# Altium schematic sheet POWER.SchDoc
size 420 x 297 mm; SheetNumber: 13; PageSetup: Record=PageOptions|CenterHorizontal=False|CenterVertical=False|PrintScale=0.95|XCorrection=0.00|YCorrection=0.00|PrintKind=1|BorderSize=5000000|LeftOffset=0|BottomOffset=0|Orientation=1|PaperLength=1000|PaperWidth=1000|Scale=100|PaperSource=15|PrintQuality=600|MediaType=1|DitherType=10|PaperKind=A4|PrintScaleMode=1
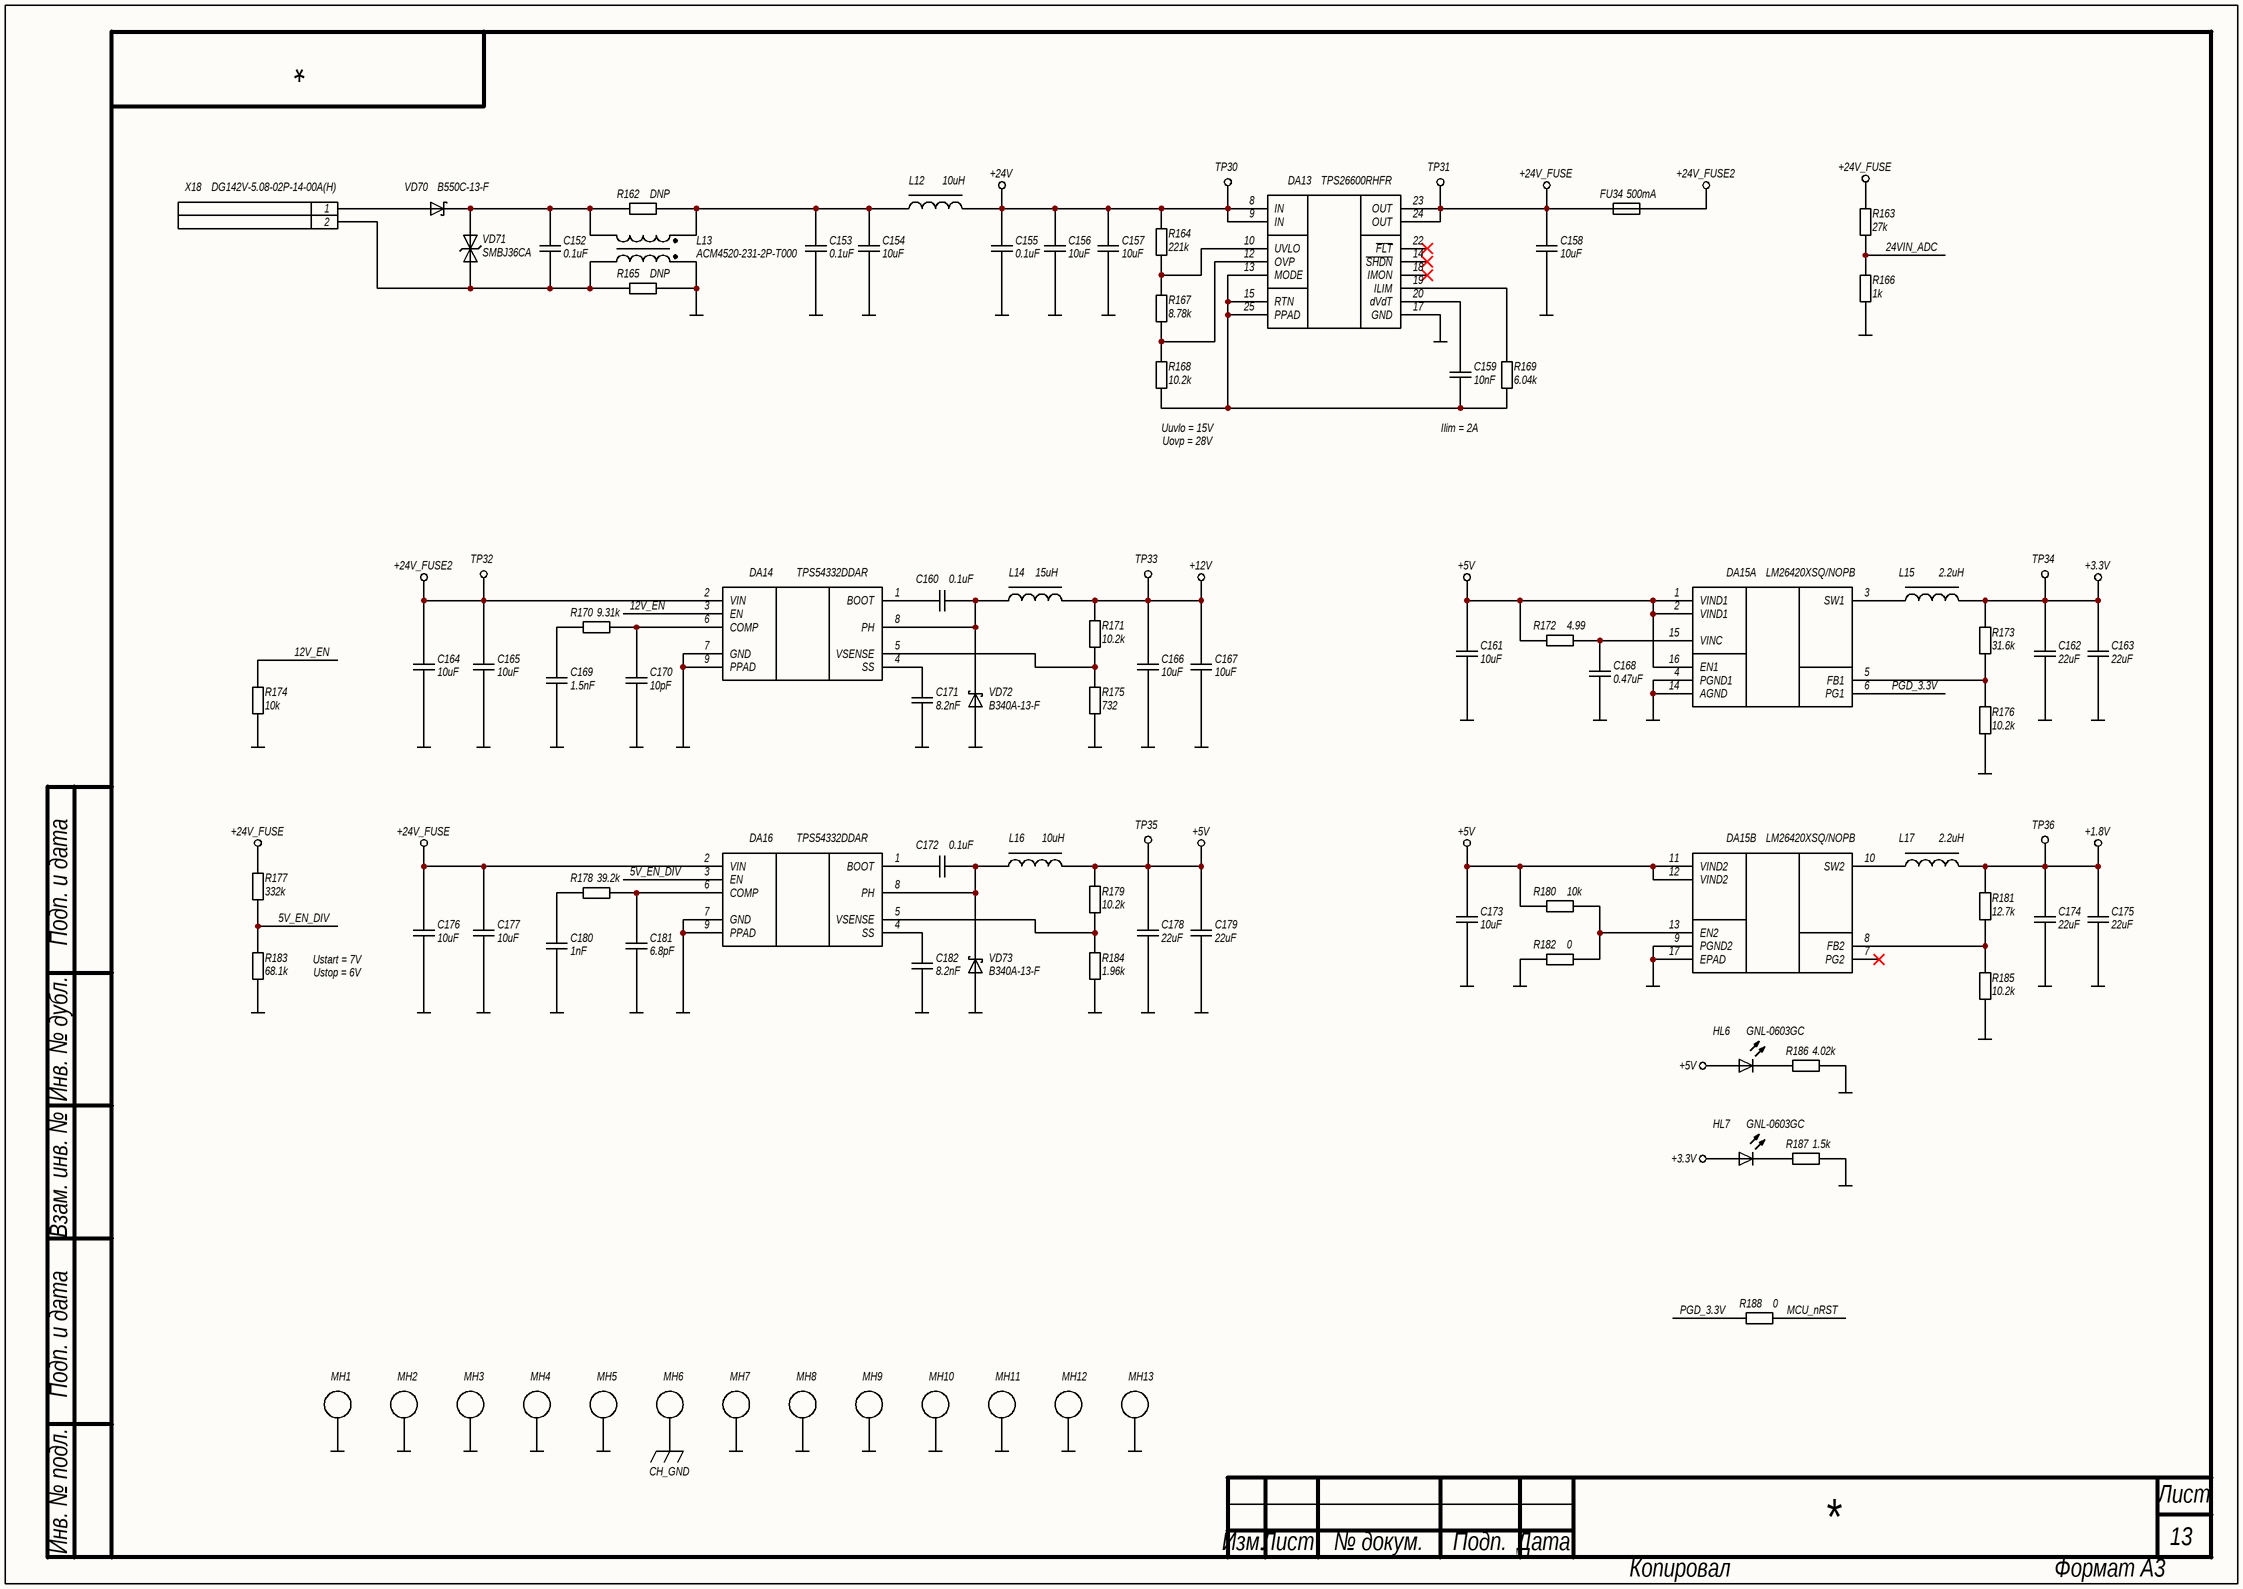
[diagram p0: POWER.SchDoc]

## Parts
C152  0.1uF  [C0805N]
C153  0.1uF  [C0805N]
C154  10uF  [C1206N]
C155  0.1uF  [C0805N]
C156  10uF  [C1206N]
C157  10uF  [C1206N]
C158  10uF  [C1206N]
C159  10nF  [C0603N]
C160  0.1uF  [C0603N]
C161  10uF  [C0805N]
C162  22uF  [C0805N]
C163  22uF  [C0805N]
C164  10uF  [C1206N]
C165  10uF  [C1206N]
C166  10uF  [C0805N]
C167  10uF  [C0805N]
C168  0.47uF  [C0603N]
C169  1.5nF  [C0603N]
C170  10pF  [C0603N]
C171  8.2nF  [C0603N]
C172  0.1uF  [C0603N]
C173  10uF  [C0805N]
C174  22uF  [C0805N]
C175  22uF  [C0805N]
C176  10uF  [C1206N]
C177  10uF  [C1206N]
C178  22uF  [C0805N]
C179  22uF  [C0805N]
C180  1nF  [C0603N]
C181  6.8pF  [C0603N]
C182  8.2nF  [C0603N]
DA13  TPS26600RHFR  [RHF0024A (VQFN-24 EP)]
DA14  TPS54332DDAR  [SOIC8-EP]
DA15  LM26420XSQ/NOPB  [RUM0016A]  (parts A,B of 2)
DA16  TPS54332DDAR  [SOIC8-EP]
FU34  500mA  [MF-MSMF]
HL6  GNL-0603GC  [LED0603]
HL7  GNL-0603GC  [LED0603]
L12  10uH  [SRN8040]
L13  ACM4520-231-2P-T000  [ACM4520]
L14  15uH  [SRN8040]
L15  2.2uH  [VLS3012HBX]
L16  10uH  [SRN8040]
L17  2.2uH  [VLS3012HBX]
MH1  MNT_HOLE_PL  [MH_3.2_5.4_PLATED_VIA]  (value not drawn)  (no BOM)
MH2  MNT_HOLE_PL  [MH_3.2_5.4_PLATED_VIA]  (value not drawn)  (no BOM)
MH3  MNT_HOLE_PL  [MH_3.2_5.4_PLATED_VIA]  (value not drawn)  (no BOM)
MH4  MNT_HOLE_PL  [MH_3.2_5.4_PLATED_VIA]  (value not drawn)  (no BOM)
MH5  MNT_HOLE_PL  [MH_3.2_5.4_PLATED_VIA]  (value not drawn)  (no BOM)
MH6  MNT_HOLE_PL  [MH_3.2_5.4_PLATED_VIA]  (value not drawn)  (no BOM)
MH7  MNT_HOLE_PL  [MH_3.2_5.4_PLATED_VIA]  (value not drawn)  (no BOM)
MH8  MNT_HOLE_PL  [MH_3.2_5.4_PLATED_VIA]  (value not drawn)  (no BOM)
MH9  MNT_HOLE_PL  [MH_3.2_5.4_PLATED_VIA]  (value not drawn)  (no BOM)
MH10  MNT_HOLE_PL  [MH_3.2_5.4_PLATED_VIA]  (value not drawn)  (no BOM)
MH11  MNT_HOLE_PL  [MH_3.2_5.4_PLATED_VIA]  (value not drawn)  (no BOM)
MH12  MNT_HOLE_PL  [MH_3.2_5.4_PLATED_VIA]  (value not drawn)  (no BOM)
MH13  MNT_HOLE_PL  [MH_3.2_5.4_PLATED_VIA]  (value not drawn)  (no BOM)
R162  DNP  [R1206N]  (no BOM)
R163  27k  [R0603N]
R164  221k  [R0603N]
R165  DNP  [R1206N]  (no BOM)
R166  1k  [R0603N]
R167  8.78k  [R0603N]
R168  10.2k  [R0603N]
R169  6.04k  [R0603N]
R170  9.31k  [R0603N]
R171  10.2k  [R0603N]
R172  4.99  [R0603N]
R173  31.6k  [R0603N]
R174  10k  [R0603N]
R175  732  [R0603N]
R176  10.2k  [R0603N]
R177  332k  [R0603N]
R178  39.2k  [R0603N]
R179  10.2k  [R0603N]
R180  10k  [R0603N]
R181  12.7k  [R0603N]
R182  0  [R0603N]
R183  68.1k  [R0603N]
R184  1.96k  [R0603N]
R185  10.2k  [R0603N]
R186  4.02k  [R0603N]
R187  1.5k  [R0603N]
R188  0  [R0603N]
TP30  TEST_POINT  [TP_RPAD_0.8MM]  (value not drawn)  (no BOM)
TP31  TEST_POINT  [TP_RPAD_0.8MM]  (value not drawn)  (no BOM)
TP32  TEST_POINT  [TP_RPAD_0.8MM]  (value not drawn)  (no BOM)
TP33  TEST_POINT  [TP_RPAD_0.8MM]  (value not drawn)  (no BOM)
TP34  TEST_POINT  [TP_RPAD_0.8MM]  (value not drawn)  (no BOM)
TP35  TEST_POINT  [TP_RPAD_0.8MM]  (value not drawn)  (no BOM)
TP36  TEST_POINT  [TP_RPAD_0.8MM]  (value not drawn)  (no BOM)
VD70  B550C-13-F  [SMC]
VD71  SMBJ36CA  [SMB]
VD72  B340A-13-F  [SMA]
VD73  B340A-13-F  [SMA]
X18  DG142V-5.08-02P-14-00A(H)  [DG142V-5.08-02P-14-00A(H)]

## Nets
+1.8V: C174.2 C175.2 L17.2 R181.1 TP36.1
+3.3V: C162.2 C163.2 HL7.2(A) L15.2 R173.1 TP34.1
+5V: C161.2 C173.2 C178.2 C179.2 DA15.1(VIND1) DA15.2(VIND1) DA15.11(VIND2) DA15.12(VIND2) DA15.16(EN1) HL6.2(A) L16.2 R172.2 R179.1 R180.2 TP35.1
+12V: C166.2 C167.2 L14.2 R171.1 TP33.1
+24V: C155.2 C156.2 C157.2 DA13.8(IN) DA13.9(IN) L12.2 R164.2 TP30.1
+24V_FUSE: C158.2 C176.2 C177.2 DA13.23(OUT) DA13.24(OUT) DA16.2(VIN) FU34.1 R163.2 R177.1 TP31.1
+24V_FUSE2: C164.2 C165.2 DA14.2(VIN) FU34.2 TP32.1
CH_GND: MH6.1
GND: C153.1 C154.1 C155.1 C156.1 C157.1 C158.1 C161.1 C162.1 C163.1 C164.1 C165.1 C166.1 C167.1 C168.1 C169.1 C170.1 C171.1 C173.1 C174.1 C175.1 C176.1 C177.1 C178.1 C179.1 C180.1 C181.1 C182.1 DA13.17(GND) DA14.7(GND) DA14.9(PPAD) DA15.4(PGND1) DA15.9(PGND2) DA15.14(AGND) DA15.17(EPAD) DA16.7(GND) DA16.9(PPAD) L13.1 MH1.1 MH2.1 MH3.1 MH4.1 MH5.1 MH7.1 MH8.1 MH9.1 MH10.1 MH11.1 MH12.1 MH13.1 R165.2 R166.1 R174.1 R175.2 R176.2 R182.2 R183.2 R184.2 R185.2 R186.1 R187.1 VD72.2(A) VD73.2(A)
5V_EN_DIV: DA16.3(EN) R177.2 R183.1
12V_EN: DA14.3(EN) R174.2
24VIN_ADC: R163.1 R166.2
MCU_nRST: R188.2
PGD_3.3V: DA15.6(PG1) R188.1
NetC152_1: C152.1 L13.2 R165.1 VD71.2(A2) X18.2
NetC152_2: C152.2 L13.3 R162.1 VD70.1(K) VD71.1(A1)
NetC153_2: C153.2 C154.2 L12.1 L13.4 R162.2
NetC159_1: C159.1 DA13.20(dVdT)
NetC159_2: C159.2 DA13.13(MODE) DA13.15(RTN) DA13.25(PPAD) R168.2 R169.1
NetC160_1: C160.1 DA14.8(PH) L14.1 VD72.1(K)
NetC160_2: C160.2 DA14.1(BOOT)
NetC168_2: C168.2 DA15.15(VINC) R172.1
NetC169_2: C169.2 R170.2
NetC170_2: C170.2 DA14.6(COMP) R170.1
NetC171_2: C171.2 DA14.4(SS)
NetC172_1: C172.1 DA16.8(PH) L16.1 VD73.1(K)
NetC172_2: C172.2 DA16.1(BOOT)
NetC180_2: C180.2 R178.2
NetC181_2: C181.2 DA16.6(COMP) R178.1
NetC182_2: C182.2 DA16.4(SS)
NetDA13_10: DA13.10(UVLO) R164.1 R167.2
NetDA13_12: DA13.12(OVP) R167.1 R168.1
NetDA13_19: DA13.19(ILIM) R169.2
NetDA14_5: DA14.5(VSENSE) R171.2 R175.1
NetDA15_3: DA15.3(SW1) L15.1
NetDA15_5: DA15.5(FB1) R173.2 R176.1
NetDA15_8: DA15.8(FB2) R181.2 R185.1
NetDA15_10: DA15.10(SW2) L17.1
NetDA15_13: DA15.13(EN2) R180.1 R182.1
NetDA16_5: DA16.5(VSENSE) R179.2 R184.1
NetHL6_1: HL6.1(K) R186.2
NetHL7_1: HL7.1(K) R187.2
NetVD70_2: VD70.2(A) X18.1

Not connected (* = marked no-connect by the designer): DA13 14(~{SHDN})* 18(IMON)* 22(~{FLT})*; DA15 7(PG2)*

## Notes on the sheet
- (near R168) Uuvlo = 15V
- (near R168) Uovp = 28V
- Ilim = 2A
- Ustart = 7V
- Ustop = 6V
- Подп. и дата
- Инв. № дубл.
- Взам. инв. №
- Инв. № подл.
- Лист
- Изм.
- № докум.
- Подп.
- Дата
- Копировал
- Формат А3

## Library data of the parts
C152 C153 C155 = CL21B104KCFNNNE: Конденсатор; Точность: 10%; Напряжение: 100V; Диэлектрик: X7R; Производитель: Samsung Electro-Mechanics; Описание: 0.1 µF ±10% 100V Ceramic Capacitor X7R 0805 (2012 Metric); Корпус: 0805 (2012 Metric); Температурный диапазон: -55°C ~ 125°C; Вид монтажа: SMD; Артикул: CL21B104KCFNNNE; Номинал: 0.1uF; Строка для документации: https://mm.digikey.com/Volume0/opasdata/d220001/medias/docus/893/CL21B104KCFNNNE_Spec.pdf; Тип элемента: Конденсатор
C154 C156-C158 C164 C165 C176 C177 = CL31B106KBHNNNE: Конденсатор; Точность: 10%; Напряжение: 50V; Диэлектрик: X7R; Производитель: Samsung Electro-Mechanics; Описание: 10 µF ±10% 50V Ceramic Capacitor X7R 1206 (3216 Metric); Корпус: 1206 (3216 Metric); Температурный диапазон: -55°C ~ 125°C; Вид монтажа: SMD; Артикул: CL31B106KBHNNNE; Номинал: 10uF; Строка для документации: https://mm.digikey.com/Volume0/opasdata/d220001/medias/docus/41/CL31B106KBHNNNE_Spec.pdf; Тип элемента: Конденсатор
C159 = CL10B103KB8NNNC: Конденсатор; Точность: 10%; Напряжение: 16V; Диэлектрик: X7R; Производитель: Samsung Electro-Mechanics; Описание: 10000 pF ±10% 50V Ceramic Capacitor X7R 0603 (1608 Metric); Корпус: 0603 (1608 Metric); Температурный диапазон: -55°C ~ 125°C; Вид монтажа: SMD; Артикул: CL10B103KB8NNNC; Номинал: 10nF; Строка для документации: https://mm.digikey.com/Volume0/opasdata/d220001/medias/docus/609/CL10B103KB8NNNC_Spec.pdf; Тип элемента: Конденсатор
C160 C172 = CL10B104KB8NNNC: Конденсатор; Точность: 10%; Напряжение: 50V; Диэлектрик: X7R; Производитель: Samsung Electro-Mechanics; Описание: 0.1 µF ±10% 50V Ceramic Capacitor X7R 0603 (1608 Metric); Корпус: 0603 (1608 Metric); Температурный диапазон: -55°C ~ 125°C; Вид монтажа: SMD; Артикул: CL10B104KB8NNNC; Номинал: 0.1uF; Строка для документации: https://mm.digikey.com/Volume0/opasdata/d220001/medias/docus/609/CL10B104KB8NNNC_Spec.pdf; Тип элемента: Конденсатор
C161 C166 C167 C173 = CL21A106KAYNNNE: Конденсатор; Точность: 10%; Напряжение: 25V; Диэлектрик: X5R; Производитель: Samsung Electro-Mechanics; Описание: 10 µF ±10% 25V Ceramic Capacitor X5R 0805 (2012 Metric); Корпус: 0805 (2012 Metric); Температурный диапазон: -55°C ~ 85°C; Вид монтажа: SMD; Артикул: CL21A106KAYNNNE; Номинал: 10uF; Строка для документации: https://mm.digikey.com/Volume0/opasdata/d220001/medias/docus/5545/CL21A106KAYNNNE%20Spec.pdf; Тип элемента: Конденсатор
C162 C163 C174 C175 C178 C179 = CL21A226MOCLRNC: Конденсатор; Точность: 20%; Напряжение: 16V; Диэлектрик: X5R; Производитель: Samsung Electro-Mechanics; Описание: 22 µF ±20% 16V Ceramic Capacitor X5R 0805 (2012 Metric); Корпус: 0805 (2012 Metric); Температурный диапазон: -55°C ~ 85°C; Вид монтажа: SMD; Артикул: CL21A226MOCLRNC; Номинал: 22uF; Строка для документации: https://mm.digikey.com/Volume0/opasdata/d220001/medias/docus/43/CL21A226MOCLRNC_Spec.pdf; Тип элемента: Конденсатор
C168 = CL10B474KA8NNNC: Конденсатор; Точность: 10%; Напряжение: 25V; Диэлектрик: X7R; Производитель: Samsung Electro-Mechanics; Описание: 0.47 µF ±10% 25V Ceramic Capacitor X7R 0603 (1608 Metric); Корпус: 0603 (1608 Metric); Температурный диапазон: -55°C ~ 125°C; Вид монтажа: SMD; Артикул: CL10B474KA8NNNC; Номинал: 0.47uF; Строка для документации: https://mm.digikey.com/Volume0/opasdata/d220001/medias/docus/41/CL10B474KA8NNNC_Spec.pdf; Тип элемента: Конденсатор
C169 = CL10B152KB8WPNC: Конденсатор; Точность: 10%; Напряжение: 50V; Диэлектрик: X7R; Производитель: Samsung Electro-Mechanics; Описание: 1500 pF ±10% 50V Ceramic Capacitor X7R 0603 (1608 Metric); Корпус: 0603 (1608 Metric); Температурный диапазон: -55°C ~ 125°C; Вид монтажа: SMD; Артикул: CL10B152KB8WPNC; Номинал: 1.5nF; Строка для документации: https://mm.digikey.com/Volume0/opasdata/d220001/medias/docus/41/CL10B152KB8WPNC_Spec.pdf; Тип элемента: Конденсатор
C170 = CL10C100CB8NNNC: Конденсатор; Точность: ±0.25pF; Напряжение: 50V; Диэлектрик: NP0; Производитель: Samsung Electro-Mechanics; Описание: 10 pF ±0.25pF 50V Ceramic Capacitor C0G, NP0 0603 (1608 Metric); Корпус: 0603 (1608 Metric); Температурный диапазон: -55°C ~ 125°C; Вид монтажа: SMD; Артикул: CL10C100CB8NNNC; Номинал: 10pF; Строка для документации: https://www.samsungsem.com/resources/file/global/support/product_catalog/MLCC.pdf; Тип элемента: Конденсатор
C171 C182 = CC0603KRX7R9BB822: Конденсатор; Точность: 10%; Напряжение: 50V; Диэлектрик: X7R; Производитель: YAGEO; Описание: 8200 pF ±10% 50V Ceramic Capacitor X7R 0603 (1608 Metric); Корпус: 0603 (1608 Metric); Температурный диапазон: -55°C ~ 125°C; Вид монтажа: SMD; Артикул: CC0603KRX7R9BB822; Номинал: 8.2nF; Строка для документации: https://www.yageo.com/upload/media/product/productsearch/datasheet/mlcc/UPY-GPHC_X7R_6.3V-to-250V_23.pdf; Тип элемента: Конденсатор
C180 = CL10B102KC8NNNC: Конденсатор; Точность: 10%; Напряжение: 100V; Диэлектрик: X7R; Производитель: Samsung Electro-Mechanics; Описание: 1000 pF ±10% 100V Ceramic Capacitor X7R 0603 (1608 Metric); Корпус: 0603 (1608 Metric); Температурный диапазон: -55°C ~ 125°C; Вид монтажа: SMD; Артикул: CL10B102KC8NNNC; Номинал: 1nF; Строка для документации: https://mm.digikey.com/Volume0/opasdata/d220001/medias/docus/1136/CL10B102KC8NNNC_Spec.pdf; Тип элемента: Конденсатор
C181 = CC0603CRNPO9BN6R8: Конденсатор; Точность: ±0.25pF; Напряжение: 50V; Диэлектрик: NP0; Производитель: YAGEO; Описание: 6.8 pF ±0.25pF 50V Ceramic Capacitor C0G, NP0 0603 (1608 Metric); Корпус: 0603 (1608 Metric); Температурный диапазон: -55°C ~ 125°C; Вид монтажа: SMD; Артикул: CC0603CRNPO9BN6R8; Номинал: 6.8pF; Строка для документации: https://www.yageo.com/upload/media/product/productsearch/datasheet/mlcc/UPY-GP_NP0_16V-to-50V_18.pdf; Тип элемента: Конденсатор
DA13 = TPS26600RHFR: Микросхема eFuse; Производитель: Texas Instruments; Описание: Electronic Fuse Regulator 2.35A 24-VQFN (5x4); Корпус: 24-VFQFN Exposed Pad; Температурный диапазон: -40°C ~ 125°C (TJ); Вид монтажа: SMD; Артикул: TPS26600RHFR; Строка для документации: https://www.ti.com/lit/ds/symlink/tps2660.pdf; Тип элемента: Микросхема
DA14 DA16 = TPS54332DDAR: Микросхема понижающего преобразователя; Производитель: Texas Instruments; Описание: Buck Switching Regulator IC Positive Adjustable 0.8V 1 Output 3.5A 8-PowerSOIC (0.154", 3.90mm Width); Корпус: 8-PowerSOIC (0.154", 3.90mm Width); Температурный диапазон: -40°C ~ 150°C (TJ); Вид монтажа: SMD; Артикул: TPS54332DDAR; Строка для документации: https://www.ti.com/lit/ds/symlink/tps54332.pdf; Тип элемента: Микросхема
DA15 = LM26420XSQ/NOPB: Производитель: Texas Instruments; Описание: Buck Switching Regulator IC Positive Adjustable 0.8V 2 Output 2A 16-WQFN Exposed Pad; Корпус: 16-WQFN (4x4); Температурный диапазон: -40°C ~ 125°C (TJ); Вид монтажа: SMD; Тип элемента: Микросхема; Артикул: LM26420XSQ/NOPB; Строка для документации: https://www.ti.com/lit/ds/symlink/lm26420.pdf
FU34 = MF-MSMF050/40X-2: Плавкий предохранитель; Напряжение: 40V; Тип: PTC Resettable Fuse; Производитель: Bourns Inc.; Описание: Polymeric PTC Resettable Fuse 40V 500 mA Ih Surface Mount 1812 (4532 Metric), Concave; Корпус: 1812 (4532 Metric), Concave; Температурный диапазон: -40°C ~ 85°C; Вид монтажа: SMD; Артикул: MF-MSMF050/40X-2; Ток: 500mA; Строка для документации: https://www.bourns.com/docs/product-datasheets/mf-msmf.pdf; Тип элемента: Предохранитель
HL6 HL7 = GNL-0603GC: Светодиод; Прямой ток: 20mA; Напряжение: 2V; Яркость: 12mcd; Цвет: Зеленый; Длина волны: 567nm; Производитель: G-nor Electronics; Описание: Green 567nm LED Indication - Discrete 2V 0603 (1608 Metric); Корпус: 0603 (1608 Metric); Температурный диапазон: -40°C ~ 80°C; Вид монтажа: SMD; Тип элемента: Диод светоизлучающий; Артикул: GNL-0603GC; Строка для документации: https://www.g-nor.com/Uploads/Ed/file/20210517/1621223120713818.doc
L12 L16 = SRN8040-100M: Дроссель с магнитопроводом; Точность: 20%; Ток номинальный: 3.1A; Ток насыщения: 3.4A; Сопротивление: 50m; Производитель: Bourns Inc.; Описание: 15 µH Semi-Shielded Drum Core, Wirewound Inductor 2.4 A 70mOhm Max Nonstandard; Корпус: 8.00mm x 8.00mm; Температурный диапазон: -40°C ~ 125°C; Вид монтажа: SMD; Артикул: SRN8040-100M; Номинал: 10uH; Строка для документации: https://www.bourns.com/docs/Product-Datasheets/SRN8040.pdf; Тип элемента: Дроссель
L13 = ACM4520-231-2P-T000: Синфазный дроссель; Номинал: 230 Ohms @ 100 MHz; Ток: 3A; Сопротивление: 50m; Тип: Common Mode Choke; Производитель: TDK Corporation; Описание: 2 Line Common Mode Choke Surface Mount 230 Ohms @ 100 MHz 3A DCR 50mOhm; Корпус: 4.70mm x 4.50mm; Температурный диапазон: -40°C ~ 85°C; Вид монтажа: SMD; Тип элемента: Фильтр ЭМП; Артикул: ACM4520-231-2P-T000; Строка для документации: https://product.tdk.com/en/system/files?file=dam/doc/product/emc/emc/cmf_cmc/catalog/cmf_commercial_power_acm4520_en.pdf
L14 = SRN8040-150M: Дроссель с магнитопроводом; Точность: 20%; Ток номинальный: 2.4A; Ток насыщения: 2.7A; Сопротивление: 70m; Производитель: Bourns Inc.; Описание: 15 µH Semi-Shielded Drum Core, Wirewound Inductor 2.4 A 70mOhm Max Nonstandard; Корпус: 8.00mm x 8.00mm; Температурный диапазон: -40°C ~ 125°C; Вид монтажа: SMD; Артикул: SRN8040-150M; Номинал: 15uH; Строка для документации: https://www.bourns.com/docs/Product-Datasheets/SRN8040.pdf; Тип элемента: Дроссель
L15 L17 = VLS3012HBX-2R2M: Дроссель с магнитопроводом; Точность: 20%; Ток номинальный: 3.15A; Ток насыщения: 3.35A; Сопротивление: 106m; Производитель: TDK Corporation; Описание: 2.2 µH Shielded Drum Core, Wirewound Inductor 3.15 A 106mOhm Max Nonstandard; Корпус: 3.00mm x 3.00mm; Температурный диапазон: -40°C ~ 105°C; Вид монтажа: SMD; Артикул: VLS3012HBX-2R2M; Номинал: 2.2uH; Строка для документации: https://product.tdk.com/en/system/files?file=dam/doc/product/inductor/inductor/smd/catalog/inductor_commercial_power_vls3012hbx_en.pdf; Тип элемента: Дроссель
MH1-MH13 = Mounting Hole, 3.2mm/5.4mm, plated, with via stiching: Монтажное отверстие, металлизированное; Тип элемента: Механический; Артикул: Mounting Hole, 3.2mm/5.4mm, plated, with via stiching; Описание: Mounting Hole, 3.2mm/5.4mm , plated, with via stiching; Тип: Mounting Hole
R162 R165 = RC1206FR-070RL: Резистор; Точность: 1%; Напряжение: 75V; Производитель: YAGEO; Описание: 0 Ohms Jumper Chip Resistor 1206 (3216 Metric) Thick Film; Корпус: 1206 (3216 Metric); Температурный диапазон: -55°C ~ 155°C; Вид монтажа: SMD; Артикул: RC1206FR-070RL; Номинал: DNP; Строка для документации: https://www.yageo.com/upload/media/product/productsearch/datasheet/rchip/PYu-RC_Group_51_RoHS_L_12.pdf; Тип элемента: Резистор
R163 = RC0603FR-0727KL: Резистор; Точность: 1%; ТКС: ±100ppm/°C; Напряжение: 75V; Производитель: YAGEO; Описание: 27 kOhms Jumper Chip Resistor 0603 (1608 Metric) Moisture Resistant Thick Film; Корпус: 0603 (1608 Metric); Температурный диапазон: -55°C ~ 155°C; Вид монтажа: SMD; Артикул: RC0603FR-0727KL; Номинал: 27k; Строка для документации: https://www.yageo.com/upload/media/product/app/datasheet/rchip/pyu-rc_group_51_rohs_l.pdf; Тип элемента: Резистор
R164 = RC0603FR-07221KL: Резистор; Точность: 1%; ТКС: ±100ppm/°C; Напряжение: 75V; Производитель: YAGEO; Описание: 221 kOhms ±1% 0.1W, 1/10W Chip Resistor 0603 (1608 Metric) Moisture Resistant Thick Film; Корпус: 0603 (1608 Metric); Температурный диапазон: -55°C ~ 155°C; Вид монтажа: SMD; Артикул: RC0603FR-07221KL; Номинал: 221k; Строка для документации: https://www.yageo.com/upload/media/product/app/datasheet/rchip/pyu-rc_group_51_rohs_l.pdf; Тип элемента: Резистор
R166 = RC0603FR-071KL: Резистор; Точность: 1%; ТКС: ±100ppm/°C; Напряжение: 75V; Производитель: YAGEO; Описание: 1 kOhms ±1% 0.1W, 1/10W Chip Resistor 0603 (1608 Metric) Moisture Resistant Thick Film; Корпус: 0603 (1608 Metric); Температурный диапазон: -55°C ~ 155°C; Вид монтажа: SMD; Артикул: RC0603FR-071KL; Номинал: 1k; Строка для документации: https://www.yageo.com/upload/media/product/app/datasheet/rchip/pyu-rc_group_51_rohs_l.pdf; Тип элемента: Резистор
R167 = RC0603FR-078K87L: Резистор; Точность: 1%; ТКС: ±100ppm/°C; Напряжение: 75V; Производитель: YAGEO; Описание: 8.87 kOhms ±1% 0.1W, 1/10W Chip Resistor 0603 (1608 Metric) Moisture Resistant Thick Film; Корпус: 0603 (1608 Metric); Температурный диапазон: -55°C ~ 155°C; Вид монтажа: SMD; Артикул: RC0603FR-078K87L; Номинал: 8.78k; Строка для документации: https://www.yageo.com/upload/media/product/app/datasheet/rchip/pyu-rc_group_51_rohs_l.pdf; Тип элемента: Резистор
R168 R171 R176 R179 R185 = RC0603FR-0710K2L: Резистор; Точность: 1%; ТКС: ±100ppm/°C; Напряжение: 75V; Производитель: YAGEO; Описание: 10.2 kOhms ±1% 0.1W, 1/10W Chip Resistor 0603 (1608 Metric) Moisture Resistant Thick Film; Корпус: 0603 (1608 Metric); Температурный диапазон: -55°C ~ 155°C; Вид монтажа: SMD; Артикул: RC0603FR-0710K2L; Номинал: 10.2k; Строка для документации: https://www.yageo.com/upload/media/product/app/datasheet/rchip/pyu-rc_group_51_rohs_l.pdf; Тип элемента: Резистор
R169 = RC0603FR-076K04L: Резистор; Точность: 1%; ТКС: ±100ppm/°C; Напряжение: 75V; Производитель: YAGEO; Описание: 6.04 kOhms ±1% 0.1W, 1/10W Chip Resistor 0603 (1608 Metric) Moisture Resistant Thick Film; Корпус: 0603 (1608 Metric); Температурный диапазон: -55°C ~ 155°C; Вид монтажа: SMD; Артикул: RC0603FR-076K04L; Номинал: 6.04k; Строка для документации: https://www.yageo.com/upload/media/product/app/datasheet/rchip/pyu-rc_group_51_rohs_l.pdf; Тип элемента: Резистор
R170 = RC0603FR-079K31L: Резистор; Точность: 1%; ТКС: ±100ppm/°C; Напряжение: 75V; Производитель: YAGEO; Описание: 9.31 kOhms ±1% 0.1W, 1/10W Chip Resistor 0603 (1608 Metric) Moisture Resistant Thick Film; Корпус: 0603 (1608 Metric); Температурный диапазон: -55°C ~ 155°C; Вид монтажа: SMD; Артикул: RC0603FR-079K31L; Номинал: 9.31k; Строка для документации: https://www.yageo.com/upload/media/product/app/datasheet/rchip/pyu-rc_group_51_rohs_l.pdf; Тип элемента: Резистор
R172 = RC0603FR-074R99L: Резистор; Точность: 1%; ТКС: ±100ppm/°C; Напряжение: 75V; Производитель: YAGEO; Описание: 4.99 Ohms ±1% 0.1W, 1/10W Chip Resistor 0603 (1608 Metric) Moisture Resistant Thick Film; Корпус: 0603 (1608 Metric); Температурный диапазон: -55°C ~ 155°C; Вид монтажа: SMD; Артикул: RC0603FR-074R99L; Номинал: 4.99; Строка для документации: https://www.yageo.com/upload/media/product/app/datasheet/rchip/pyu-rc_group_51_rohs_l.pdf; Тип элемента: Резистор
R173 = RC0603FR-0731K6L: Резистор; Точность: 1%; ТКС: ±100ppm/°C; Напряжение: 75V; Производитель: YAGEO; Описание: 31.6 kOhms ±1% 0.1W, 1/10W Chip Resistor 0603 (1608 Metric) Moisture Resistant Thick Film; Корпус: 0603 (1608 Metric); Температурный диапазон: -55°C ~ 155°C; Вид монтажа: SMD; Артикул: RC0603FR-0731K6L; Номинал: 31.6k; Строка для документации: https://www.yageo.com/upload/media/product/app/datasheet/rchip/pyu-rc_group_51_rohs_l.pdf; Тип элемента: Резистор
R174 R180 = RC0603FR-0710KL: Резистор; Точность: 1%; ТКС: ±100ppm/°C; Напряжение: 75V; Производитель: YAGEO; Описание: 10 kOhms ±1% 0.1W, 1/10W Chip Resistor 0603 (1608 Metric) Moisture Resistant Thick Film; Корпус: 0603 (1608 Metric); Температурный диапазон: -55°C ~ 155°C; Вид монтажа: SMD; Артикул: RC0603FR-0710KL; Номинал: 10k; Строка для документации: https://www.yageo.com/upload/media/product/app/datasheet/rchip/pyu-rc_group_51_rohs_l.pdf; Тип элемента: Резистор
R175 = RC0603FR-07732RL: Резистор; Точность: 1%; ТКС: ±100ppm/°C; Напряжение: 75V; Производитель: YAGEO; Описание: 732 Ohms ±1% 0.1W, 1/10W Chip Resistor 0603 (1608 Metric) Moisture Resistant Thick Film; Корпус: 0603 (1608 Metric); Температурный диапазон: -55°C ~ 155°C; Вид монтажа: SMD; Артикул: RC0603FR-07732RL; Номинал: 732; Строка для документации: https://www.yageo.com/upload/media/product/app/datasheet/rchip/pyu-rc_group_51_rohs_l.pdf; Тип элемента: Резистор
R177 = RC0603FR-07332KL: Резистор; Точность: 1%; ТКС: ±100ppm/°C; Напряжение: 75V; Производитель: YAGEO; Описание: 332 kOhms ±1% 0.1W, 1/10W Chip Resistor 0603 (1608 Metric) Moisture Resistant Thick Film; Корпус: 0603 (1608 Metric); Температурный диапазон: -55°C ~ 155°C; Вид монтажа: SMD; Артикул: RC0603FR-07332KL; Номинал: 332k; Строка для документации: https://www.yageo.com/upload/media/product/app/datasheet/rchip/pyu-rc_group_51_rohs_l.pdf; Тип элемента: Резистор
R178 = RC0603FR-0739K2L: Резистор; Точность: 1%; ТКС: ±100ppm/°C; Напряжение: 75V; Производитель: YAGEO; Описание: 39.2 kOhms ±1% 0.1W, 1/10W Chip Resistor 0603 (1608 Metric) Moisture Resistant Thick Film; Корпус: 0603 (1608 Metric); Температурный диапазон: -55°C ~ 155°C; Вид монтажа: SMD; Артикул: RC0603FR-0739K2L; Номинал: 39.2k; Строка для документации: https://www.yageo.com/upload/media/product/app/datasheet/rchip/pyu-rc_group_51_rohs_l.pdf; Тип элемента: Резистор
R181 = RC0603FR-0712K7L: Резистор; Точность: 1%; ТКС: ±100ppm/°C; Напряжение: 75V; Производитель: YAGEO; Описание: 12.7 kOhms ±1% 0.1W, 1/10W Chip Resistor 0603 (1608 Metric) Moisture Resistant Thick Film; Корпус: 0603 (1608 Metric); Температурный диапазон: -55°C ~ 155°C; Вид монтажа: SMD; Артикул: RC0603FR-0712K7L; Номинал: 12.7k; Строка для документации: https://www.yageo.com/upload/media/product/app/datasheet/rchip/pyu-rc_group_51_rohs_l.pdf; Тип элемента: Резистор
R182 R188 = RC0603FR-070RL: Резистор; Точность: 1%; Напряжение: 75V; Производитель: YAGEO; Описание: 0 Ohms Jumper Chip Resistor 0603 (1608 Metric) Moisture Resistant Thick Film; Корпус: 0603 (1608 Metric); Температурный диапазон: -55°C ~ 155°C; Вид монтажа: SMD; Артикул: RC0603FR-070RL; Номинал: 0; Строка для документации: https://www.yageo.com/upload/media/product/app/datasheet/rchip/pyu-rc_group_51_rohs_l.pdf; Тип элемента: Резистор
R183 = RC0603FR-0768K1L: Резистор; Точность: 1%; ТКС: ±100ppm/°C; Напряжение: 75V; Производитель: YAGEO; Описание: 68.1 kOhms ±1% 0.1W, 1/10W Chip Resistor 0603 (1608 Metric) Moisture Resistant Thick Film; Корпус: 0603 (1608 Metric); Температурный диапазон: -55°C ~ 155°C; Вид монтажа: SMD; Артикул: RC0603FR-0768K1L; Номинал: 68.1k; Строка для документации: https://www.yageo.com/upload/media/product/app/datasheet/rchip/pyu-rc_group_51_rohs_l.pdf; Тип элемента: Резистор
R184 = RC0603FR-071K96L: Резистор; Точность: 1%; ТКС: ±100ppm/°C; Напряжение: 75V; Производитель: YAGEO; Описание: 1.96 kOhms ±1% 0.1W, 1/10W Chip Resistor 0603 (1608 Metric) Moisture Resistant Thick Film; Корпус: 0603 (1608 Metric); Температурный диапазон: -55°C ~ 155°C; Вид монтажа: SMD; Артикул: RC0603FR-071K96L; Номинал: 1.96k; Строка для документации: https://www.yageo.com/upload/media/product/app/datasheet/rchip/pyu-rc_group_51_rohs_l.pdf; Тип элемента: Резистор
R186 = RC0603FR-074K02L: Резистор; Точность: 1%; ТКС: ±100ppm/°C; Напряжение: 75V; Производитель: YAGEO; Описание: 4.02 kOhms ±1% 0.1W, 1/10W Chip Resistor 0603 (1608 Metric) Moisture Resistant Thick Film; Корпус: 0603 (1608 Metric); Температурный диапазон: -55°C ~ 155°C; Вид монтажа: SMD; Артикул: RC0603FR-074K02L; Номинал: 4.02k; Строка для документации: https://www.yageo.com/upload/media/product/app/datasheet/rchip/pyu-rc_group_51_rohs_l.pdf; Тип элемента: Резистор
R187 = RC0603FR-071K5L: Резистор; Точность: 1%; ТКС: ±100ppm/°C; Напряжение: 75V; Производитель: YAGEO; Описание: 1.5 kOhms ±1% 0.1W, 1/10W Chip Resistor 0603 (1608 Metric) Moisture Resistant Thick Film; Корпус: 0603 (1608 Metric); Температурный диапазон: -55°C ~ 155°C; Вид монтажа: SMD; Артикул: RC0603FR-071K5L; Номинал: 1.5k; Строка для документации: https://www.yageo.com/upload/media/product/app/datasheet/rchip/pyu-rc_group_51_rohs_l.pdf; Тип элемента: Резистор
TP30-TP36 = Test Point, Round Pad, 0.8mm diameter: Контрольная точка; Количество контактов: 1; Тип элемента: Разъем; Артикул: Test Point, Round Pad, 0.8mm diameter; Тип разъема: Test Point; Описание: Test Point, Round Pad, 0.8mm diameter
VD70 = B550C-13-F: Диод Шоттки; Прямой ток: 5A; Напряжение: 50V; Производитель: Diodes Incorporated; Описание: Diode 50 V 5A Surface Mount SMC; Корпус: DO-214AB, SMC; Температурный диапазон: -55°C ~ 150°C; Вид монтажа: SMD; Артикул: B550C-13-F; Тип: Schottky; Строка для документации: https://www.diodes.com/assets/Datasheets/B520C-B560C.pdf; Тип элемента: Диод
VD71 = SMBJ36CA: TVS диод двунаправленный; Напряжение: 36V; Напряжение ограничения: 58.1V; Напряжение пробоя: 40V; Ток: 10.4A; Тип: TVS Bidirectional; Производитель: Bourns Inc.; Описание: 58.1V Clamp 10.4A Ipp Tvs Diode Surface Mount SMB (DO-214AA); Корпус: DO-214AA, SMB; Температурный диапазон: -55°C ~ 150°C (TJ); Вид монтажа: SMD; Тип элемента: Диод защитный; Артикул: SMBJ36CA; Строка для документации: https://www.bourns.com/docs/Product-Datasheets/SMBJ.pdf
VD72 VD73 = B340A-13-F: Диод Шоттки; Прямой ток: 3A; Напряжение: 40V; Производитель: Diodes Incorporated; Описание: Diode 40 V 3A Surface Mount SMA; Корпус: DO-214AC, SMA; Температурный диапазон: -55°C ~ 150°C; Вид монтажа: SMD; Артикул: B340A-13-F; Тип: Schottky; Строка для документации: https://www.diodes.com/assets/Datasheets/ds30891.pdf; Тип элемента: Диод
X18 = DG142V-5.08-02P-14-00A(H): Разъем, 2 контакта; Тип разъема: Push-Button terminal block; Количество контактов: 2; Шаг контактов: 5.08mm; Ток: 10A; Напряжение: 300V; Производитель: Degson Electronics; Описание: 2 Position Wire to Board Terminal Block Vertical with Board 0.200" (5.08mm) Through Hole; Температурный диапазон: -40°C ~ 105°C; Вид монтажа: Through Hole; Артикул: DG142V-5.08-02P-14-00A(H); Строка для документации: https://static.chipdip.ru/lib/309/DOC000309412.pdf; Тип элемента: Разъем